# EasyEDA schematic SCH_Dashboy camera_NiMH_2023-03-29.json
TITLE: Dashboy Camera PCB; REV: 1.0; Date: 2023-03-13; Sheet: 1/1; Company: by Raphaël BOICHOT
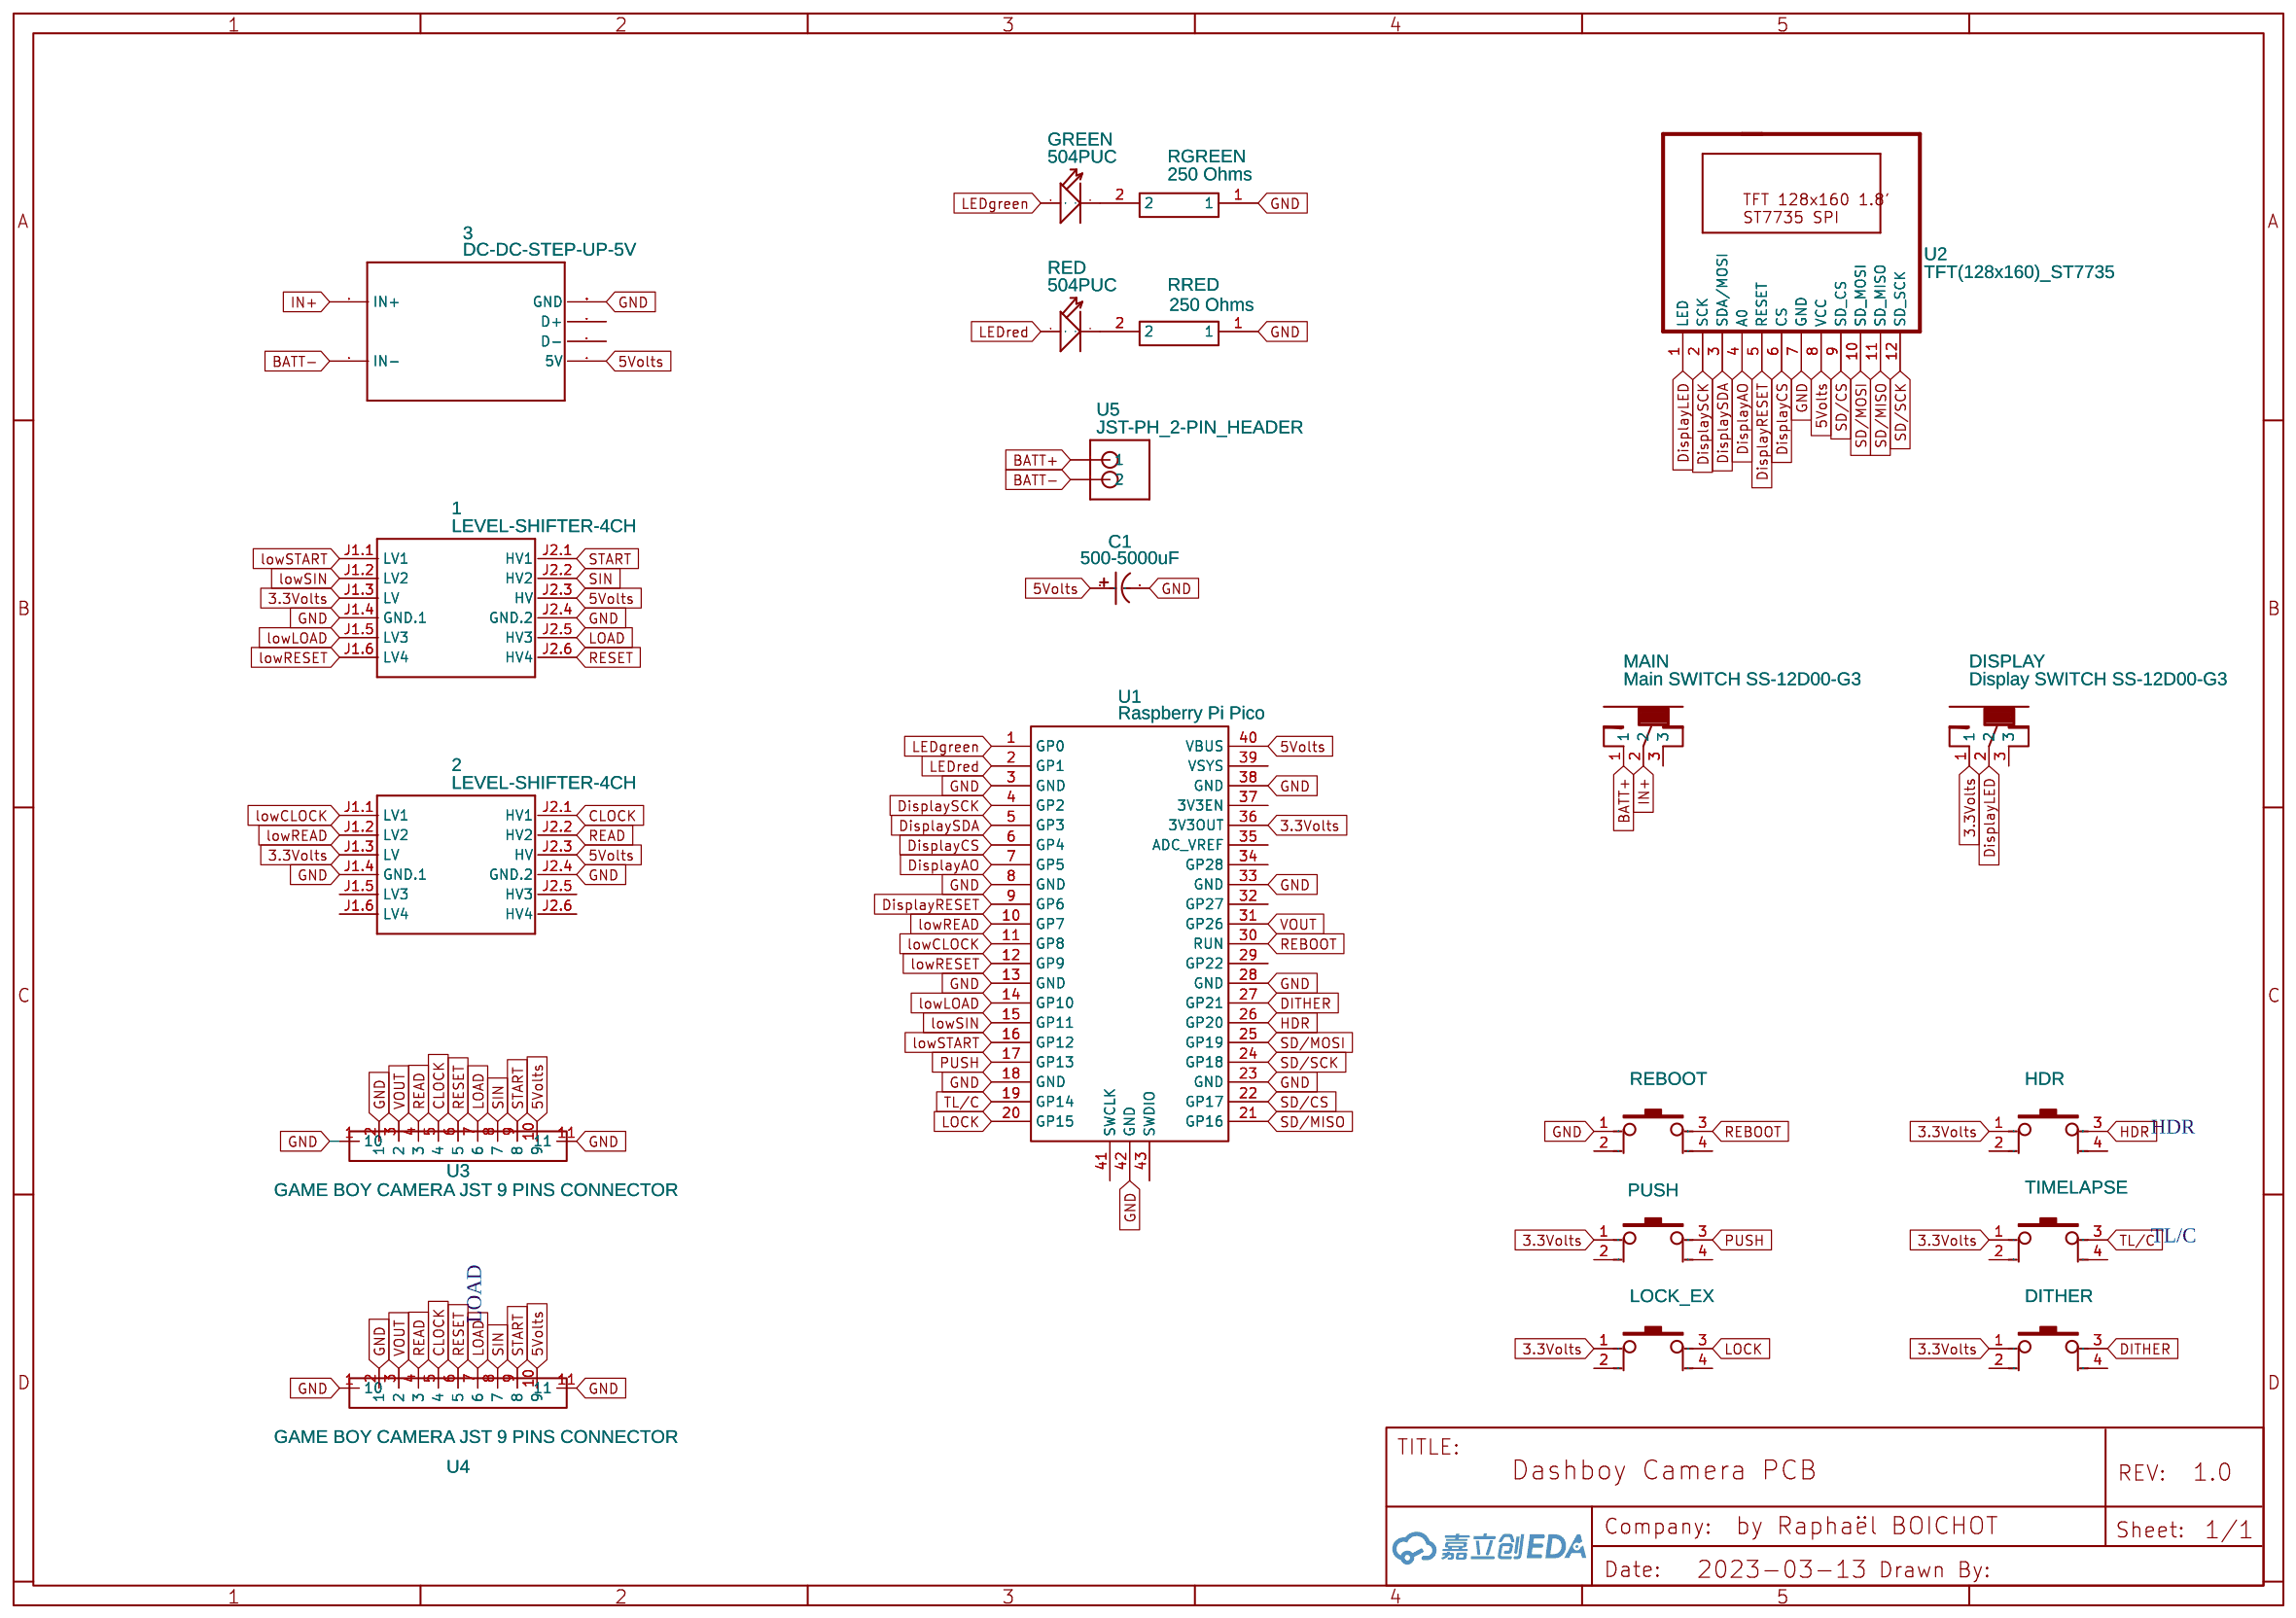
[diagram p0: schematic sheet]

## Parts
1  LEVEL-SHIFTER-4CH  [LEVEL-SHIFTER-4CH]
2  LEVEL-SHIFTER-4CH  [LEVEL-SHIFTER-4CH]
3  DC-DC-STEP-UP-5V  [DC-DC-STEP-UP-5V]
C1  500-5000uF  [CAP-TH_BD5.0-P2.00-D0.8-FD]
DISPLAY  Display SWITCH SS-12D00-G3  [TOGGLE SWITCH SS-12D00-G3]
DITHER  BoutonPoussoir  [BOUTONPUSH]
GREEN  504PUC  [LED2-2.54-D5.0MM]
HDR  BoutonPoussoir  [BOUTONPUSH]
LOCK_EX  BoutonPoussoir  [BOUTONPUSH]
MAIN  Main SWITCH SS-12D00-G3  [TOGGLE SWITCH SS-12D00-G3]
PUSH  BoutonPoussoir  [BOUTONPUSH]
REBOOT  BoutonPoussoir  [BOUTONPUSH]
RED  504PUC  [LED2-2.54-D5.0MM]
RGREEN  250 Ohms  [RESISTOR]
RRED  250 Ohms  [RESISTOR]
TIMELAPSE  BoutonPoussoir  [BOUTONPUSH]
U1  Raspberry Pi Pico  [RASPBERRY-PI-PICO]
U2  TFT(128x160)_ST7735  [MI_TFT1,8_SPI_128X160ST7735S]
U3  GAME BOY CAMERA JST 9 PINS CONNECTOR  [GAME BOY CAMERA JST 9 PINS CONNECTOR]
U4  GAME BOY CAMERA JST 9 PINS CONNECTOR  [GAME BOY CAMERA JST 9 PINS CONNECTOR]
U5  JST-PH_2-PIN_HEADER  [JST_B2B-PH_HEADER]

## Library data of the parts
1 2 = LEVEL-SHIFTER-4CH: Contributor: Thafhan Fathur Rahman
3 = DC-DC-STEP-UP-5V: Contributor: mariusz.kacprzak
C1 = electrolytic capacitor 10UF 50V high frequency: Supplier: LCSC; Manufacturer: CX(承兴); Manufacturer Part: GR106M050D11RR0VK2FP0; Supplier Part: C78759; JLCPCB Part Class: Extended Part
DISPLAY MAIN = TOGGLE SWITCH SS-12D00-G3: Supplier: aliexpress; Manufacturer: Dailywell; Contributor: Gibo222; link: https://de.aliexpress.com/item/32756772435.html?spm=a2g0o.productlist.0.0.4e077708sX2Al2&algo_pvid=716abed2-2433-4a4c-8d27-293a4e4961c2&algo_expid=716abed2-2433-4a4c-8d27-293a4e4961c2-8&btsid=2100bddd16119266912771087e59d6&ws_ab_test=searchweb0_0,searchweb201602_,searchweb201603_
DITHER HDR LOCK_EX PUSH REBOOT TIMELAPSE = BoutonPoussoir: Supplier Part: C59982; Supplier: LCSC; Manufacturer: ReliaPro; Manufacturer Part: button6*6*8; image: http://image.lceda.cn/szlcsc/C59982.jpg; Contributor: Marwane 0306
GREEN RED = 504PUC: DIP LED Transparent-Purple-5mm;
RGREEN RRED = RESITOR: Contributor: rander
U1 = Raspberry Pi Pico: Contributor: ostrander.jm
U2 = TFT(128x160)_ST7735: Contributor: Rafael Angel González; Package Display: No
U3 U4 = GAME BOY CAMERA JST 9 PINS CONNECTOR: Contributor: raphael.boichot
U5 = JST-PH_2-PIN_HEADER

## Nets
3.3Volts: 1.J1.3(LV) 2.J1.3(LV) DISPLAY.1 DITHER.1 HDR.1 LOCK_EX.1 PUSH.1 TIMELAPSE.1 U1.36(3V3OUT)
5Volts: 1.J2.3(HV) 2.J2.3(HV) 3.5V C1.1 U1.40(VBUS) U2.8(VCC) U3.10(9) U4.10(9)
GND: 1.J1.4(GND.1) 1.J2.4(GND.2) 2.J1.4(GND.1) 2.J2.4(GND.2) 3.GND C1.2 REBOOT.1 RGREEN.1 RRED.1 U1.3(GND) U1.8(GND) U1.13(GND) U1.18(GND) U1.23(GND) U1.28(GND) U1.33(GND) U1.38(GND) U1.42(GND) U2.7(GND) U3.1(10) U3.2(1) U3.11 U4.1(10) U4.2(1) U4.11
BATT+: MAIN.1 U5.P1(1)
BATT-: 3.IN- U5.P2(2)
CLOCK: 2.J2.1(HV1) U3.5(4) U4.5(4)
DisplayAO: U1.7(GP5) U2.4(A0)
DisplayCS: U1.6(GP4) U2.6(CS)
DisplayLED: DISPLAY.2 U2.1(LED)
DisplayRESET: U1.9(GP6) U2.5(RESET)
DisplaySCK: U1.4(GP2) U2.2(SCK)
DisplaySDA: U1.5(GP3) U2.3(SDA/MOSI)
DITHER: DITHER.3 U1.27(GP21)
HDR: HDR.3 U1.26(GP20)
IN+: 3.IN+ MAIN.2
LEDgreen: GREEN.+ U1.1(GP0)
LEDred: RED.+ U1.2(GP1)
LOAD: 1.J2.5(HV3) U3.7(6) U4.7(6)
LOCK: LOCK_EX.3 U1.20(GP15)
lowCLOCK: 2.J1.1(LV1) U1.11(GP8)
lowLOAD: 1.J1.5(LV3) U1.14(GP10)
lowREAD: 2.J1.2(LV2) U1.10(GP7)
lowRESET: 1.J1.6(LV4) U1.12(GP9)
lowSIN: 1.J1.2(LV2) U1.15(GP11)
lowSTART: 1.J1.1(LV1) U1.16(GP12)
PUSH: PUSH.3 U1.17(GP13)
READ: 2.J2.2(HV2) U3.4(3) U4.4(3)
REBOOT: REBOOT.3 U1.30(RUN)
RESET: 1.J2.6(HV4) U3.6(5) U4.6(5)
SD/CS: U1.22(GP17) U2.9(SD_CS)
SD/MISO: U1.21(GP16) U2.11(SD_MISO)
SD/MOSI: U1.25(GP19) U2.10(SD_MOSI)
SD/SCK: U1.24(GP18) U2.12(SD_SCK)
SIN: 1.J2.2(HV2) U3.8(7) U4.8(7)
START: 1.J2.1(HV1) U3.9(8) U4.9(8)
TL/C: TIMELAPSE.3 U1.19(GP14)
VOUT: U1.31(GP26) U3.3(2) U4.3(2)
Net-(GREEN--): GREEN.- RGREEN.2
Net-(RED--): RED.- RRED.2

Not connected (* = marked no-connect by the designer): 2 J1.5(LV3) J1.6(LV4) J2.5(HV3) J2.6(HV4); 3 D+ D-; DISPLAY 3; DITHER 2 4; HDR 2 4; LOCK_EX 2 4; MAIN 3; PUSH 2 4; REBOOT 2 4; TIMELAPSE 2 4; U1 29(GP22) 32(GP27) 34(GP28) 35(ADC_VREF) 37(3V3EN) 39(VSYS) 41(SWCLK) 43(SWDIO)

## Notes on the sheet
- HDR
- TL/C
- LOAD
